# EAGLE design simple_schematic (EAGLE 9.0.1)
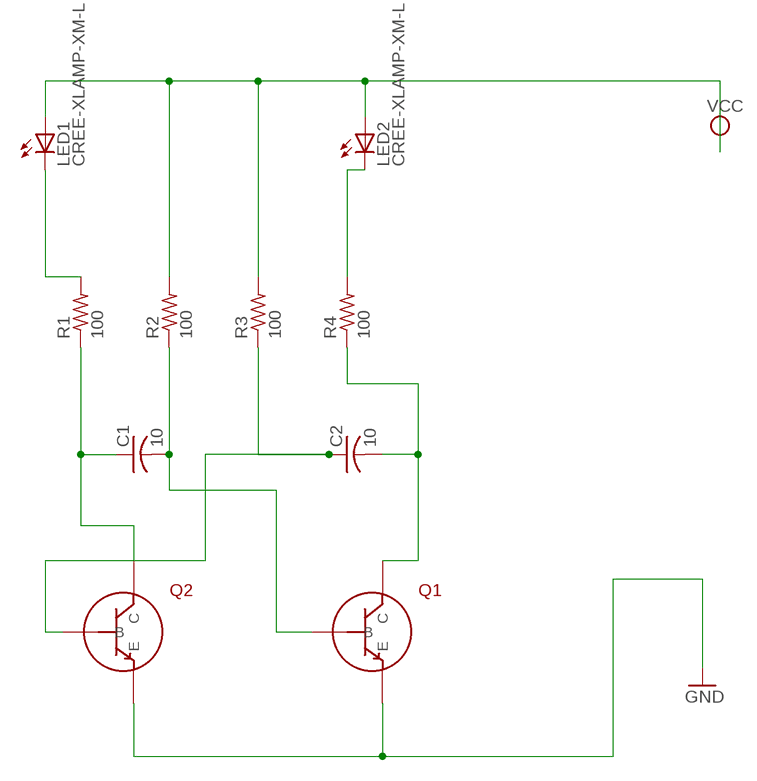
[diagram p0: schematic, sheet 1]

## Parts
C1  10  C-US025-024X044  [C025-024X044]
C2  10  C-US025-024X044  [C025-024X044]
LED1  CREE-XLAMP-XM-L  [CREE-XLAMP-XM-L]
LED2  CREE-XLAMP-XM-L  [CREE-XLAMP-XM-L]
Q1  BJT_NPN  (no package)
Q2  BJT_NPN  (no package)
R1  100  R-US_0204/2V  [0204V]
R2  100  R-US_0204/2V  [0204V]
R3  100  R-US_0204/2V  [0204V]
R4  100  R-US_0204/2V  [0204V]

## Nets
GND: Q1.E Q2.E
N$1: LED2.C LED2.C@1(C) R4.2
N$2: LED1.C LED1.C@1(C) R1.2
N$3: C1.1 Q2.C R1.1
N$4: C1.2 Q1.B R2.1
N$5: C2.1 Q2.B R3.1
N$6: C2.2 Q1.C R4.1
VCC: LED1.A LED1.A@1(A) LED2.A LED2.A@1(A) R2.2 R3.2

## Library data of the parts
C1 C2 = resistor:C-US: CAPACITOR, American symbol
LED1 LED2 = led:CREE-XLAMP-XM-L: Cree® XLamp® XM-L LEDs Source: http://www.cree.com
Q1 Q2 = ngspice-simulation:BJT_NPN: Bipolar NPN Transistor
R1-R4 = rcl:R-US_: RESISTOR, American symbol; SPICEPREFIX: R

## Board
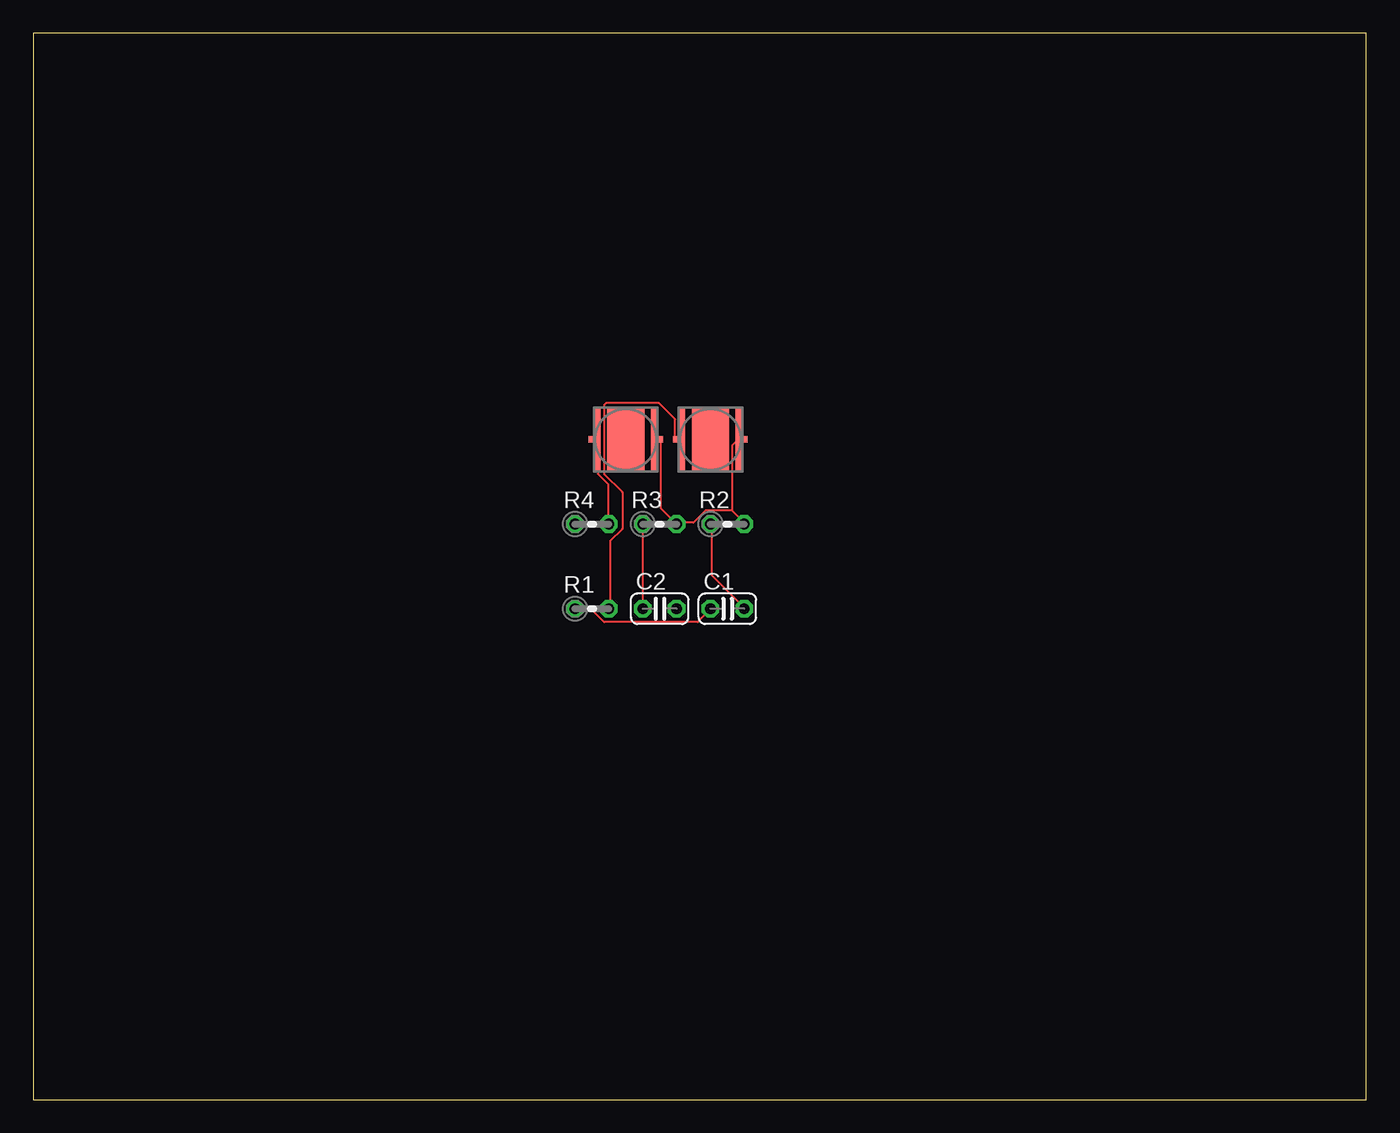
[diagram p1: board, top side]
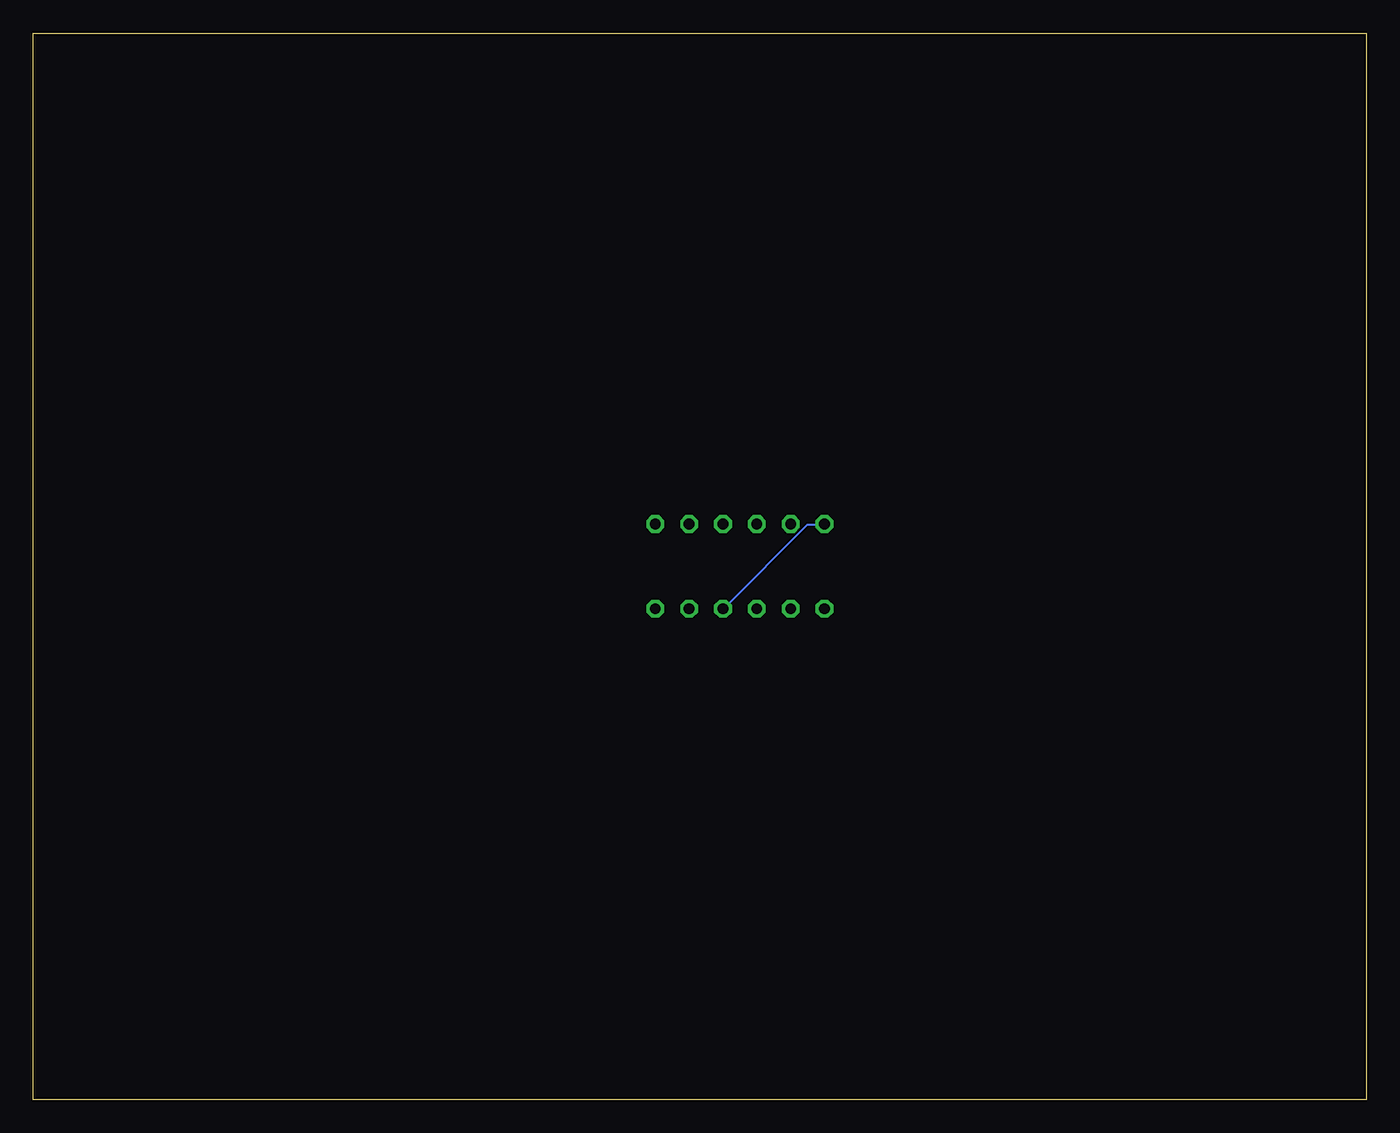
[diagram p2: board, bottom side, seen from below]

Size 100 x 80 mm. Coordinates in mm from the lower left corner, seen from the top.
Outline: 0,0 100,0 100,80 0,80 0,0
Copper layers (1*16): Top 0.035mm / dielectric 1.5mm / Bottom 0.035mm
Design rules "default": minimum track width 6mil, minimum drill 0.35mm, track to track 6mil, track to pad 6mil, pad to pad 6mil, via to via 6mil, smd to smd 6mil, copper to edge 40mil, drill to drill 6mil, minimum pad ring 10mil, minimum via ring 8mil, stop-mask expansion 4mil, vias tented up to drill 0mil, thermal gap 10mil

### Footprints (pad centres in the part's own frame; a part is rotated, then mirrored left to right if it is on the bottom)
C025-024X044 = drill 0.813 octagon: 1 -1.27,0; 2 1.27,0
CREE-XLAMP-XM-L = smd 0.5 x 4.8: A 2.141,0; C -2.141,0 | smd 0.5 x 0.5: A@1 2.54,0; C@1 -2.54,0 | smd 2.782 x 4.8: EXP 0,0
0204V = drill 0.813 octagon: 1 -1.27,0; 2 1.27,0

### Placement (x,y rotation side)
C1  52.07,36.83 0 top
C2  46.99,36.83 0 top
LED1  50.8,49.53 0 top
LED2  44.45,49.53 0 top
R1  41.91,36.83 0 top
R2  52.07,43.18 0 top
R3  46.99,43.18 0 top
R4  41.91,43.18 0 top

### Tracks (layer width: path | path; a pad name or v marks a point on that pad's centre or on a via)
N$1
  Top 0.152: LED2.C@1 LED2.C 42.37,49.53 42.37,46.94 43.13,46.18 43.13,43.28 R4.2
N$2
  Top 0.152: LED1.C LED1.C@1 48.16,49.53 48.16,51.05 46.94,52.27 42.98,52.27 42.82,52.12 42.82,46.94 44.2,45.57 44.2,42.82 43.28,41.91 43.28,36.88 R1.2
N$3
  Top 0.152: R1.1 40.69,36.73 41.91,36.73 42.82,35.81 49.84,35.81 50.75,36.73 C1.1
N$4
  Top 0.152: R2.1 50.9,43.13 50.9,39.32 53.34,36.88 C1.2
N$5
  Top 0.152: R3.1 C2.1
N$6
  Bottom 0.152: R4.1 40.69,43.13 41.91,43.13 48.16,36.88 C2.2
VCC
  Top 0.152: LED2.A LED2.A@1 47.09,49.53 47.09,44.35 R3.2 48.31,43.28 49.53,43.28 50.44,44.2 52.43,44.2 | 52.43,44.2 53.34,43.28 R2.2 | LED1.A@1 LED1.A 52.88,49.53 52.43,49.07 52.43,44.2